# Altium schematic sheet RS485.SchDoc
size 420 x 297 mm; Revision: V1.2.1; SheetNumber: 12; SheetTotal: 12
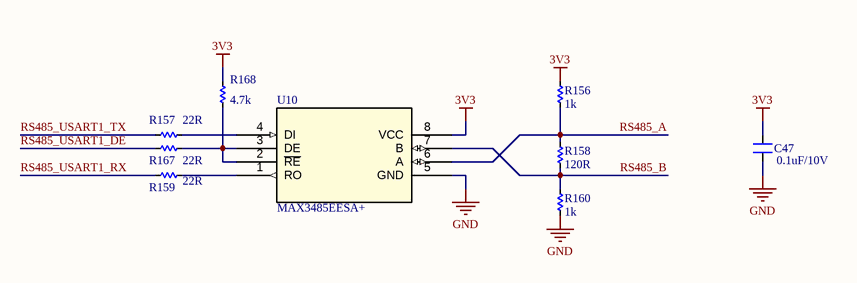
[diagram p0: RS485.SchDoc]

## Parts
C47  0.1uF/10V  [CAP_C_1608X80]
R156  1k  [RES_C_1608X60]
R157  22R  [RES_C_1608X60]
R158  120R  [RES_C_1608X60]
R159  22R  [RES_C_1608X60]
R160  1k  [RES_C_1608X60]
R167  22R  [RES_C_1608X60]
R168  4.7k  [RES_C_1608X60]
U10  MAX3485EESA+  [SOIC8_3.9mm]

## Nets
3V3: C47.2 R156.1 R168.1 U10.8(VCC)
GND: C47.1 R160.2 U10.5(GND)
RS485_A: R156.2 R158.1 U10.6(A)
RS485_B: R158.2 R160.1 U10.7(B)
RS485_USART1_DE: R167.2
RS485_USART1_RX: R159.2
RS485_USART1_TX: R157.2
NetR157_1: R157.1 U10.4(DI)
NetR159_1: R159.1 U10.1(RO)
NetR167_1: R167.1 R168.2 U10.2(~{RE}) U10.3(DE)

## Notes on the sheet
- Project:
- BEE-PC1
- Sub-system:
- Design by:
- SAMY VE
- BAO BUI Q.
- Sheet title:
- Sheet
- A3
- of
- Checked by:
- Approved by:
- VU PHAM
- Revision:
- Document No:
- Size:
- Date:

## Library data of the parts
C47 = Capacitors: Value: 33pF
R156-R160 R167 R168 = Res SMD: SMD; Manufacturer: Generic Components; Class: Passive; Published: 08/06/2000; Publisher: Altium Hobart Technology Centre
U10 = MAX3485EESA+: IC TRANSCEIVER HALF 1/1 8SOIC; Mfr_Name: Analog Devices Inc; RefDes: RefDes; Type: Type